# EAGLE design ds3231 (EAGLE 9.2.2)
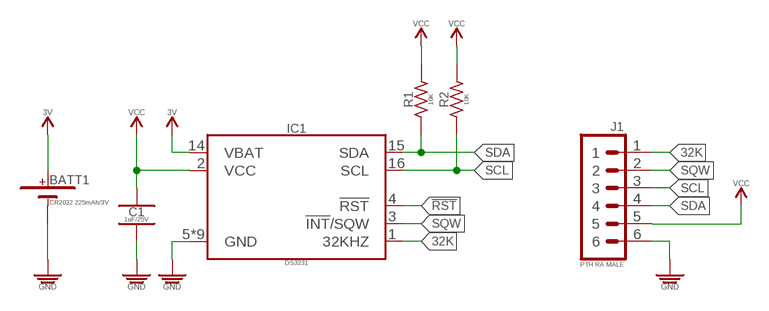
[diagram p0: schematic, sheet 1]

## Parts
BATT1  CR2032 225mAh/3V  BATTERY_COIN-CELL_SMD_3V_20MM  [CR-2032]
C1  1uF/25V  1UF_CER_SMD-0402_25V-10%  [CAPC1005X55_SMD-0402]
IC1  DS3231  DS3231_DS3231_RTC_CLK_I2C_SOIC-16  [SOIC127P1032X265-16]
J1  PTH RA MALE  1X06PTH_RA_MALE_2.54MM  [HDRRA6W64P254_1X6_1524X254X254B]
R1  10K  10KΩ_SMD-0402_1/16W-5%  [RESC1005X35_SMD-0402]
R2  10K  10KΩ_SMD-0402_1/16W-5%  [RESC1005X35_SMD-0402]

## Nets
3V: BATT1.+_1(+) BATT1.+_2(+) IC1.14(VBAT)
32K: IC1.1(32KHZ) J1.1
!RST: IC1.4(!RST)
GND: BATT1.- C1.2 IC1.5(GND) IC1.6(GND) IC1.7(GND) IC1.8(GND) IC1.9(GND) IC1.10(GND) IC1.11(GND) IC1.12(GND) IC1.13(GND) J1.6
SCL: IC1.16(SCL) J1.3 R2.1
SDA: IC1.15(SDA) J1.4 R1.1
SQW: IC1.3(!INT!/SQW) J1.2
VCC: C1.1 IC1.2(VCC) J1.5 R1.2 R2.2

## Library data of the parts
BATT1 = PiB_batteries:BATTERY_COIN-CELL; DATASHEET: https://media.digikey.com/pdf/Data%20Sheets/Panasonic%20Inustrial/CR_Series.pdf; DATASHEET_CONNECTOR: https://linxtechnologies.com/wp/wp-content/uploads/bat-hld-001.pdf; DIST: Digikey; DISTPN: P189-ND; DISTPN_CONNECTOR: BAT-HLD-001-ND; DIST_CONNECTOR: Digikey; MFR: Panasonic - BSG; MFR_CONNECTOR: Linx Technologies Inc.; MPN: CR2032; MPN_CONNECTOR: BAT-HLD-001
C1 = PiB_capacitors:1UF; DATASHEET: https://product.tdk.com/info/en/catalog/datasheets/mlcc_commercial_lowprofile_en.pdf; DIST: Digikey; DISTLINK: https://www.digikey.com/products/en?keywords=445-13185-1-ND; DISTPN: 445-13185-1-ND; MFR: TDK Corporation; MPN: CGB2A1X5R1E105K033BC
IC1 = PiB:DS3231; DATASHEET: https://datasheets.maximintegrated.com/en/ds/DS3231-DS3231S.pdf; DIST: Digikey; DISTLINK: https://www.digikey.com/products/en?keywords=DS3231S%23T%26RCT-ND; DISTPN: DS3231S#T&RCT-ND; MFR: Maxim Integrated; MPN: DS3231S#T&R
J1 = PiB_connectors:1X06; DATASHEET: https://s3.amazonaws.com/catalogspreads-pdf/PAGE112-113%20.100%20MALE%20HDR.pdf; DIST: Digikey; DISTLINK: https://www.digikey.com/products/en?keywords=S1112E-06-ND; DISTPN: S1112E-06-ND; MFR: Sullins Connector Solutions; MPN: PEC06SBAN
R1 R2 = PiB_resistors:10KΩ; DATASHEET: http://www.yageo.com/NewPortal/yageodocoutput?fileName=/pdf/R-Chip/PYu-RC_51_RoHS_P_0.pdf; DIST: Digikey; DISTLINK: https://www.digikey.com/products/en?keywords=YAG1281CT-ND; DISTPN: YAG1281CT-ND; MFR: Yageo; MPN: RC0402JR-0710KP

## Board
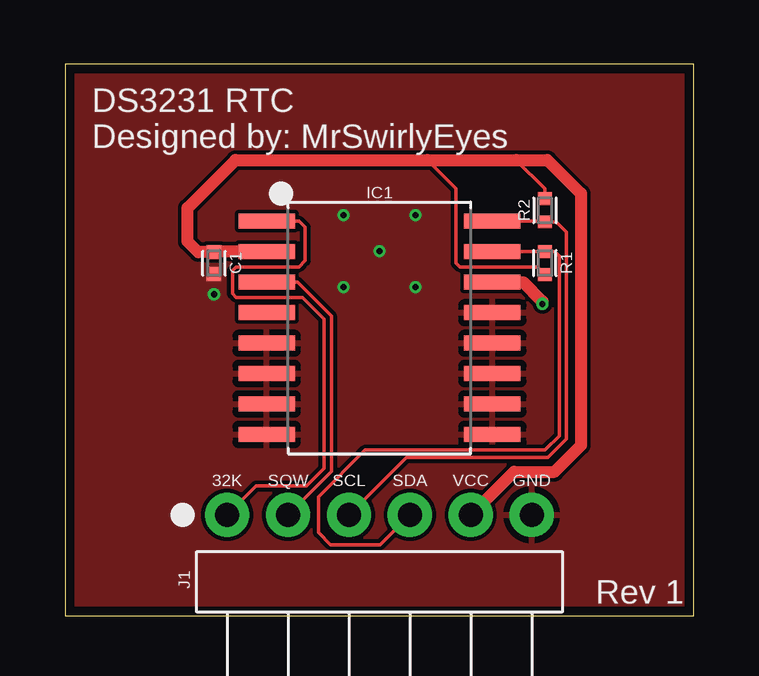
[diagram p1: board, top side]
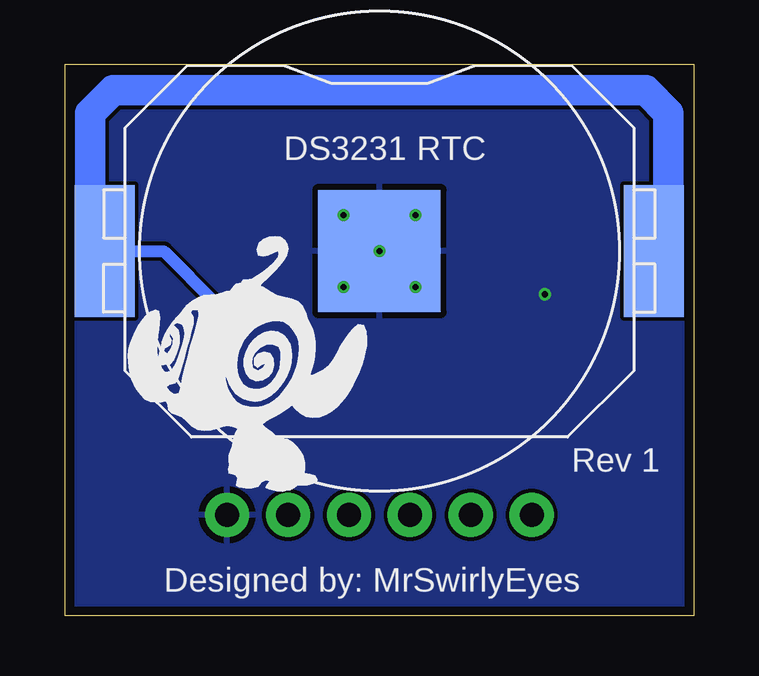
[diagram p2: board, bottom side, seen from below]

Size 26.2 x 23 mm. Coordinates in mm from the lower left corner, seen from the top.
Outline: 0,0 26.2,0 26.2,23 0,23 0,0
Copper layers (1*16): Top 0.035559375mm / dielectric 1.6mm / Bottom 0.035559375mm
Design rules "oshpark-2layer": minimum track width 6mil, minimum drill 10mil, track to track 6mil, track to pad 6mil, pad to pad 6mil, via to via 6mil, smd to smd 6mil, copper to edge 15mil, drill to drill 6mil, minimum pad ring 5mil, minimum via ring 5mil, stop-mask expansion 2.5mil, vias tented up to drill 0mil, thermal gap 10mil

### Footprints (pad centres in the part's own frame; a part is rotated, then mirrored left to right if it is on the bottom)
CR-2032 = smd 2.5 x 5.5: +_1 -11.45,0; +_2 11.45,0 | smd 5.1 x 5.1: - 0,0
CAPC1005X55_SMD-0402 = smd 0.585 x 0.612: 1 -0.458,0; 2 0.458,0
SOIC127P1032X265-16 = smd 2.352 x 0.629: 1 -4.704,4.445; 2 -4.704,3.175; 3 -4.704,1.905; 4 -4.704,0.635; 5 -4.704,-0.635; 6 -4.704,-1.905; 7 -4.704,-3.175; 8 -4.704,-4.445; 9 4.704,-4.445; 10 4.704,-3.175; 11 4.704,-1.905; 12 4.704,-0.635; 13 4.704,0.635; 14 4.704,1.905; 15 4.704,3.175; 16 4.704,4.445
HDRRA6W64P254_1X6_1524X254X254B = drill 1 pad 1.85: 1 -6.35,0; 2 -3.81,0; 3 -1.27,0; 4 1.27,0; 5 3.81,0; 6 6.35,0
RESC1005X35_SMD-0402 = smd 0.535 x 0.6: 1 -0.482,0; 2 0.482,0

### Placement (x,y rotation side)
BATT1  13.1,15.2 180 bottom
C1  6.2,14.7 270 top
IC1  13.1,12 0 top
J1  13.1,4.2 0 top
R1  20,14.7 270 top
R2  20,16.9 90 top
U$1  [MRSWIRLYEYES-LOGO]  18.6,10.5 0 bottom

### Tracks (layer width: path | path; a pad name or v marks a point on that pad's centre or on a via)
3V  (via drill 0.25)
  Top 0.508: IC1.14 19.09,13.9 19.9,13.1 v19.9,13
  Bottom 0.508: BATT1.+_2 22.1,15.2 v19.9,13
  Bottom 1.27: BATT1.+_2 24.55,15.6 25.15,16.2 25.15,20.95 24.2,21.9 2,21.9 1.05,20.95 1.05,16.2 1.65,15.6 BATT1.+_1
32K
  Top 0.152: J1.1 7.95,5.4 10.06,5.4 10.79,6.14 10.79,12.37 9.9,13.27 7.13,13.27 6.98,13.42 6.98,14.39 7.13,14.54 9.74,14.54 10,14.8 10,16.2 9.75,16.45 IC1.1
GND  (via drill 0.25)
  other vias: 6.2,13.4 13.1,15.2 14.6,16.7 11.6,16.7 11.6,13.7 14.6,13.7
  pour Bottom: 0,23 0,0 26.2,0 26.2,23
  pour Top: 0,23 0,0 26.2,0 26.2,23
SCL
  Top 0.152: IC1.16 20,16.45 R2.1 20.48,16.42 20.91,16 20.91,7.37 20.13,6.59 14.22,6.59 J1.3
SDA
  Top 0.152: IC1.15 R1.1 20.42,15.18 20.6,15 20.6,7.5 20,6.9 12.5,6.9 10.56,4.96 10.56,3.46 11.07,2.96 13.13,2.96 J1.4
SQW
  Top 0.152: J1.2 11.1,6.01 11.1,12.5 9.7,13.9 IC1.3
VCC
  Top 0.152: R2.2 20,17.8 18.8,19 | 15.1,19 16.3,17.8 16.3,14.7 16.46,14.54 19.68,14.54 R1.2
  Top 0.508: IC1.2 6.22,15.18 C1.1 5.54,15.16 5.1,15.6 5.1,17 7.1,19 15.1,19 18.8,19 20.1,19 21.5,17.6 21.5,7.1 20.4,6 18.71,6 J1.5

### Text on the board
tPlace: DS3231 RTC | Designed by: MrSwirlyEyes | 32K | SQW | SCL | SDA | VCC | GND | Rev 1
bPlace: DS3231 RTC | Rev 1 | Designed by: MrSwirlyEyes